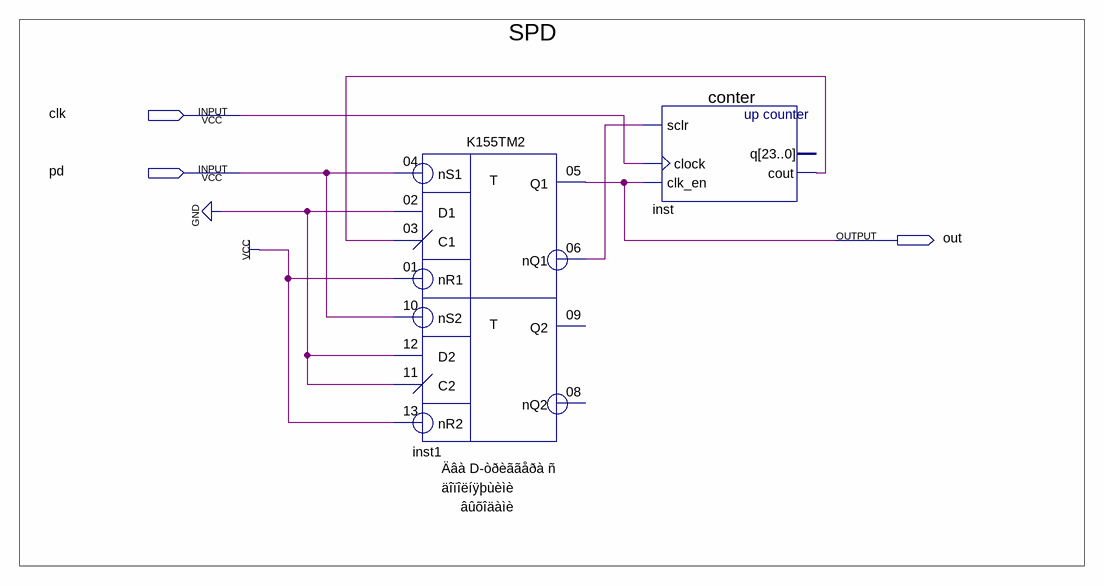
[diagram p0: schematic sheet]
// Quartus schematic SPD.bdf as structural Verilog: 2 symbols, 3 pins
module SPD (
  input  clk,
  input  pd,
  output out
);

  wire inst1_nq1, inst_cout;

  K155TM2 inst1 (
    .nS1(pd), .nR1(1'b1), .C1(inst_cout), .D1(1'b0), .nS2(pd), .nR2(1'b1), .C2(1'b0), .D2(1'b0), .Q1(out),
    .nQ1(inst1_nq1));  // open: Q2, nQ2
  conter inst (.sclr(inst1_nq1), .clock(clk), .clk_en(out), .cout(inst_cout));  // open: q

  // Notes on the sheet:
  //   SPD
endmodule
